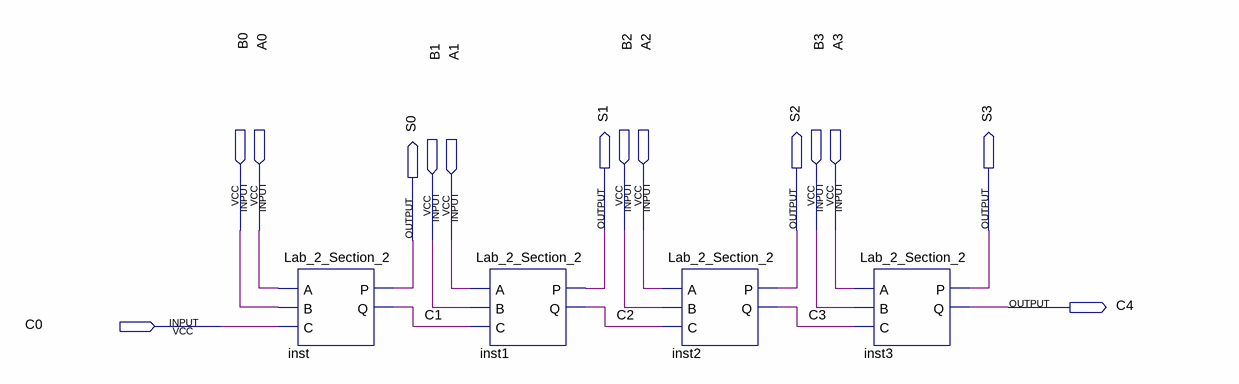
[diagram p0: schematic sheet]
// Quartus schematic Lab_2_Section_3.bdf as structural Verilog: 4 symbols, 14 pins
module Lab_2_Section_3 (
  input  B0,
  input  A0,
  input  B2,
  input  A2,
  input  B3,
  input  A3,
  input  B1,
  input  A1,
  input  C0,
  output S1,
  output S2,
  output S3,
  output S0,
  output C4
);

  wire C1, C2, C3;

  Lab_2_Section_2 inst (.A(A0), .B(B0), .C(C0), .P(S0), .Q(C1));
  Lab_2_Section_2 inst1 (.A(A1), .B(B1), .C(C1), .P(S1), .Q(C2));
  Lab_2_Section_2 inst2 (.A(A2), .B(B2), .C(C2), .P(S2), .Q(C3));
  Lab_2_Section_2 inst3 (.A(A3), .B(B3), .C(C3), .P(S3), .Q(C4));
endmodule
